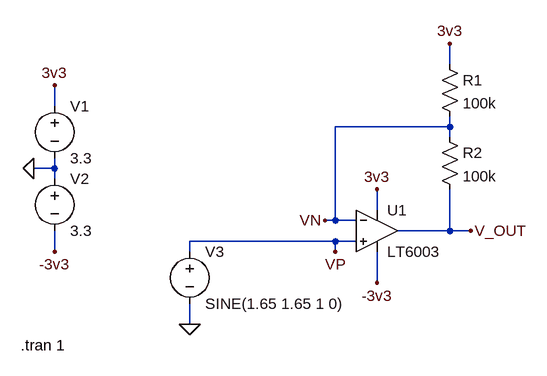
[diagram p0: schematic LT6003_R2R_Test.asc]
LT6003_R2R_Test.asc, the LTspice schematic file:
Version 4
SHEET 1 880 680
WIRE 336 -48 336 -80
WIRE -272 16 -272 -16
WIRE 336 48 336 32
WIRE 336 48 160 48
WIRE 336 64 336 48
WIRE -272 112 -272 96
WIRE -272 112 -304 112
WIRE -272 128 -272 112
WIRE 224 176 224 144
WIRE 160 192 160 48
WIRE 160 192 144 192
WIRE 192 192 160 192
WIRE 336 208 336 144
WIRE 336 208 256 208
WIRE 368 208 336 208
WIRE 160 224 -64 224
WIRE 192 224 160 224
WIRE -272 240 -272 208
WIRE -64 240 -64 224
WIRE 160 240 160 224
WIRE 224 288 224 240
WIRE -64 352 -64 320
FLAG 224 144 3v3
FLAG 336 -80 3v3
FLAG 224 288 -3v3
FLAG -304 112 0
FLAG -272 -16 3v3
FLAG -272 240 -3v3
FLAG -64 352 0
FLAG 160 240 VP
FLAG 144 192 VN
FLAG 368 208 V_OUT
SYMBOL Opamps\\LT6003 224 208 R0
SYMATTR InstName U1
SYMBOL res 320 -64 R0
SYMATTR InstName R1
SYMATTR Value 100k
SYMBOL res 320 48 R0
SYMATTR InstName R2
SYMATTR Value 100k
SYMBOL voltage -272 0 R0
WINDOW 123 0 0 Left 2
WINDOW 39 0 0 Left 2
SYMATTR InstName V1
SYMATTR Value 3.3
SYMBOL voltage -272 112 R0
WINDOW 123 0 0 Left 2
WINDOW 39 0 0 Left 2
SYMATTR InstName V2
SYMATTR Value 3.3
SYMBOL voltage -64 224 R0
WINDOW 123 0 0 Left 2
WINDOW 39 0 0 Left 2
SYMATTR InstName V3
SYMATTR Value SINE(1.65 1.65 1 0)
TEXT -324 384 Left 2 !.tran 1

The netlist it stands for:
* LT6003_R2R_Test.asc
* U1: LT6003 (symbol Opamps\LT6003 not available, pins judged from their places): In+=VP In-=VN V+=3v3 V-=-3v3 OUT=V_OUT
R1 3v3 VN 100k
R2 VN V_OUT 100k
V1 3v3 0 3.3
V2 0 -3v3 3.3
V3 VP 0 SINE(1.65 1.65 1 0)
.tran 1
.backanno
.end